# EAGLE design v4.0 (EAGLE 7.5.0)
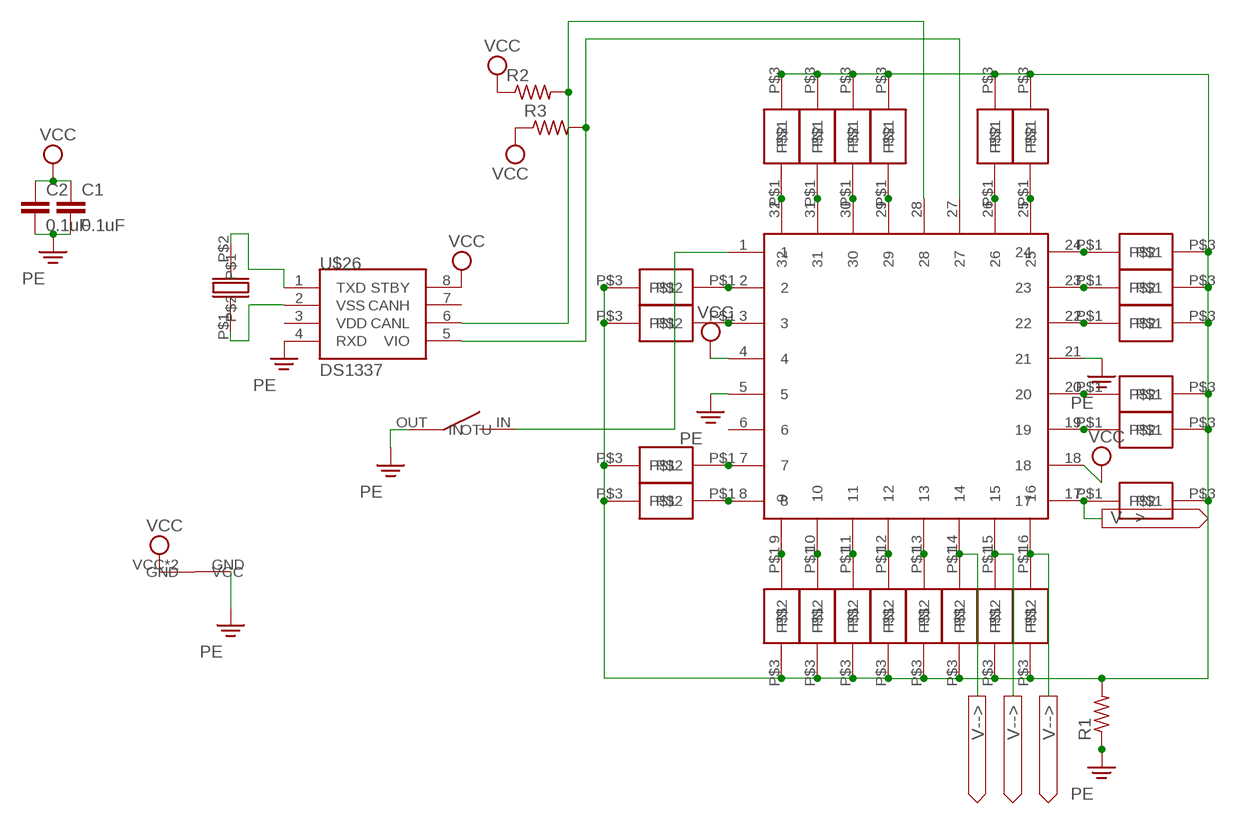
[diagram p0: schematic, sheet 1]

## Parts
C1  0.1uF  C-EUC0805K  [C0805K]
C2  0.1uF  C-EUC0805K  [C0805K]
R1  R-US_R0805  [R0805]
R2  R-US_R0805  [R0805]
R3  R-US_R0805  [R0805]
U$1  SMDLED  [SMDLED]
U$2  SMDLED  [SMDLED]
U$3  SMDLED  [SMDLED]
U$4  SMDLED  [SMDLED]
U$5  SMDLED  [SMDLED]
U$6  SMDLED  [SMDLED]
U$7  SMDLED  [SMDLED]
U$8  SMDLED  [SMDLED]
U$9  SMDLED  [SMDLED]
U$10  SMDLED  [SMDLED]
U$11  SMDLED  [SMDLED]
U$12  SMDLED  [SMDLED]
U$13  SMDLED  [SMDLED]
U$14  SMDLED  [SMDLED]
U$15  SMDLED  [SMDLED]
U$16  SMDLED  [SMDLED]
U$17  SMDLED  [SMDLED]
U$18  SMDLED  [SMDLED]
U$19  SMDLED  [SMDLED]
U$20  SMDLED  [SMDLED]
U$21  SMDLED  [SMDLED]
U$22  SMDLED  [SMDLED]
U$23  SMDLED  [SMDLED]
U$24  SMDLED  [SMDLED]
U$25  ATTINY88  [32-TQFT]
U$26  DS1337  [8-SOIC]
U$27  BAT2009  [BAT2009]
U$28  INT2  [INT2]
U$29  SMDCRYSTAL  [SMDCRYSTAL]

## Nets
N$1: U$16.P$1 U$25.2
N$2: U$17.P$1 U$25.3
N$3: U$7.P$1 U$25.7
N$4: U$8.P$1 U$25.8
N$5: U$18.P$1 U$25.9
N$6: U$19.P$1 U$25.10
N$7: U$20.P$1 U$25.11
N$8: U$1.P$1 U$25.12
N$9: U$2.P$1 U$25.13
N$10: U$4.P$1 U$25.15
N$11: U$3.P$1 U$25.14
N$12: U$5.P$1 U$25.16
N$13: U$11.P$1 U$25.17
N$14: U$24.P$1 U$25.26
N$15: U$9.P$1 U$25.25
N$16: U$6.P$1 U$25.24
N$17: U$22.P$1 U$25.23
N$18: U$21.P$1 U$25.22
N$19: U$25.1 U$28.IN
N$20: U$10.P$1 U$25.20
N$21: U$23.P$1 U$25.29
N$22: U$13.P$1 U$25.30
N$23: U$14.P$1 U$25.31
N$24: U$15.P$1 U$25.32
N$25: R1.2 U$1.P$3 U$2.P$3 U$3.P$3 U$4.P$3 U$5.P$3 U$6.P$3 U$7.P$3 U$8.P$3 U$9.P$3 U$10.P$3 U$11.P$3 U$12.P$3 U$13.P$3 U$14.P$3 U$15.P$3 U$16.P$3 U$17.P$3 U$18.P$3 U$19.P$3 U$20.P$3 U$21.P$3 U$22.P$3 U$23.P$3 U$24.P$3
N$26: U$12.P$1 U$25.19
N$29: U$26.2(VSS) U$29.P$1
N$30: U$26.1(TXD) U$29.P$2
PE: C1.2 C2.2 R1.1 U$25.5 U$25.21 U$26.4(RXD) U$27.GND U$28.OUT(OTU)
SCL: R2.2 U$25.28 U$26.6(CANL)
SDA: R3.2 U$25.27 U$26.5(VIO)
VCC: C1.1 C2.1 R2.1 R3.1 U$25.4 U$25.18 U$26.8(STBY) U$27.VCC U$27.VCC2(VCC)
Unconnected: U$25.6 U$26.3(VDD) U$26.7(CANH)

## Library data of the parts
C1 C2 = rcl:C-EU: CAPACITOR, European symbol
R1-R3 = resistor:R-US_: RESISTOR, American symbol
U$1-U$24 = custom:SMDLED
U$25 = custom:ATTINY88
U$26 = _custom:DS1337
U$27 = custom:BAT2009
U$28 = custom:INT2
U$29 = custom:SMDCRYSTAL

## Board
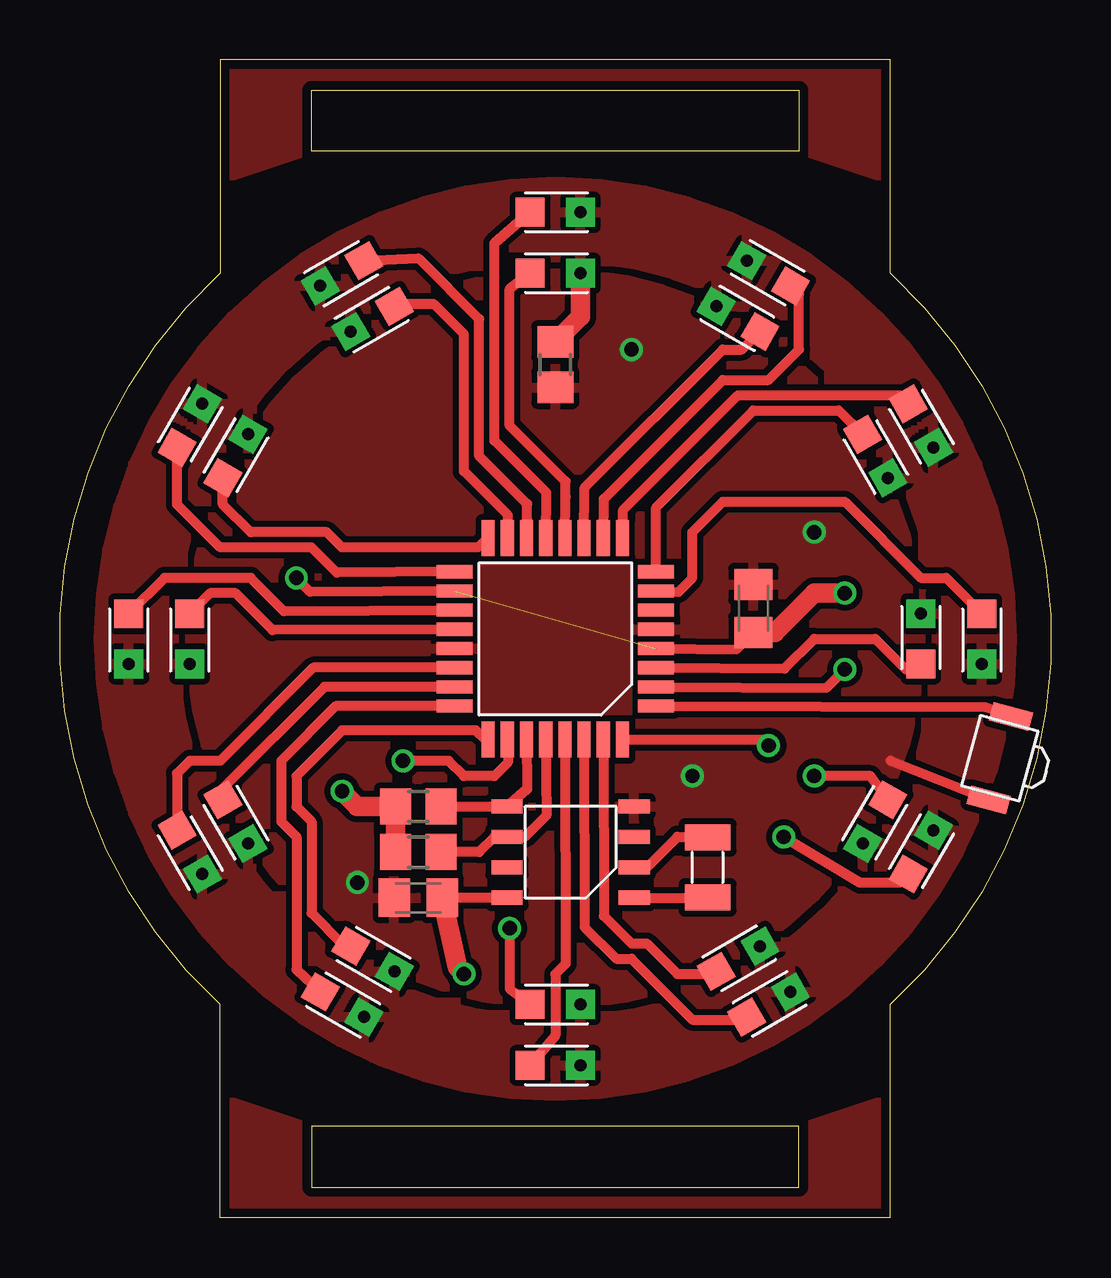
[diagram p1: board, top side]
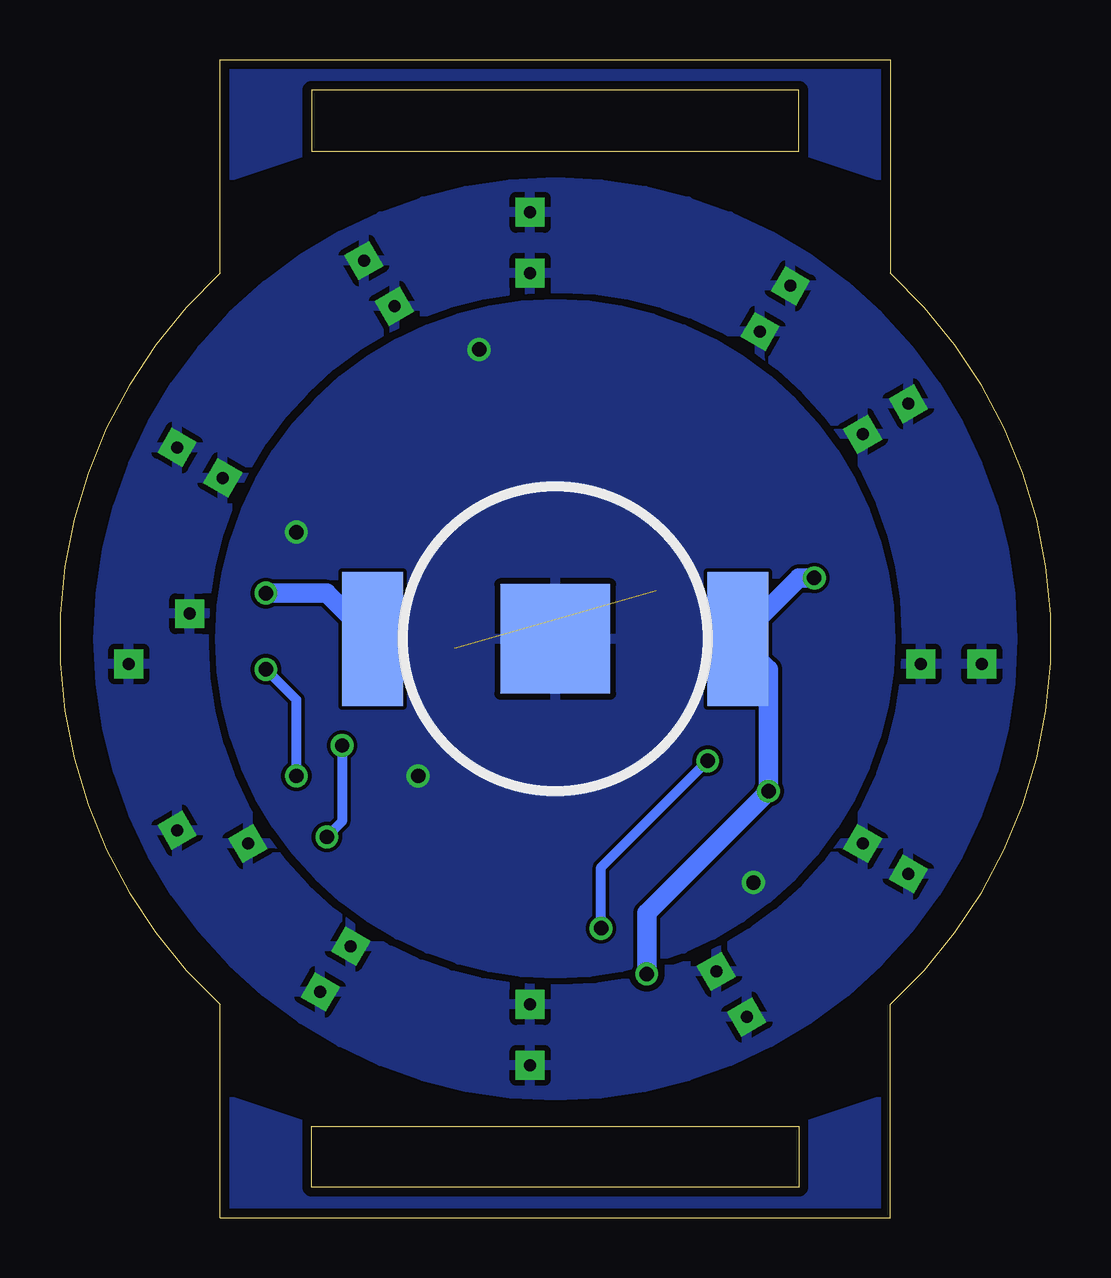
[diagram p2: board, bottom side, seen from below]

Size 41.3 x 48.26 mm. Coordinates in mm from the lower left corner, seen from the top.
Outline: 34.62,0 6.68,0 6.68,8.89 arc-95 6.68,39.37 6.68,48.26 34.62,48.26 34.62,39.37 arc-95 34.62,8.89 34.62,0
Outline: 10.49,1.27 30.81,1.27 30.81,3.81 10.49,3.81 10.49,1.27
Outline: 10.49,46.99 30.81,46.99 30.81,44.45 10.49,44.45 10.49,46.99
Copper layers (1*16): Top 0.0356mm / dielectric 1.5011mm / Bottom 0.0356mm
Design rules "oshpark-2layer": minimum track width 6mil, minimum drill 13mil, track to track 6mil, track to pad 6mil, pad to pad 6mil, via to via 6mil, smd to smd 6mil, copper to edge 15mil, drill to drill 6mil, minimum pad ring 7mil, minimum via ring 7mil, stop-mask expansion 2.5mil, vias tented up to drill 0mil, thermal gap 10mil

### Footprints (pad centres in the part's own frame; a part is rotated, then mirrored left to right if it is on the bottom)
C0805K = smd 1.3 x 1.6: 1 -1,0; 2 1,0
R0805 = smd 1.3 x 1.5: 1 -0.95,0; 2 0.95,0
SMDLED = smd 1.2 x 1.2: P$1 0,1.05 | drill 0.5 pad 1.2 square: P$3 0,-1.05
32-TQFT = smd 1.5 x 0.55: 1 -4.2,2.8; 2 -4.2,2; 3 -4.2,1.2; 4 -4.2,0.4; 5 -4.2,-0.4; 6 -4.2,-1.2; 7 -4.2,-2; 8 -4.2,-2.8; 17 4.2,-2.8; 18 4.2,-2; 19 4.2,-1.2; 20 4.2,-0.4; 21 4.2,0.4; 22 4.2,1.2; 23 4.2,2; 24 4.2,2.8 | smd 0.55 x 1.5: 9 -2.8,-4.2; 10 -2,-4.2; 11 -1.2,-4.2; 12 -0.4,-4.2; 13 0.4,-4.2; 14 1.2,-4.2; 15 2,-4.2; 16 2.8,-4.2; 25 2.8,4.2; 26 2,4.2; 27 1.2,4.2; 28 0.4,4.2; 29 -0.4,4.2; 30 -1.2,4.2; 31 -2,4.2; 32 -2.8,4.2
8-SOIC = smd 1.3 x 0.6: 1 -2.65,1.905; 2 -2.65,0.635; 3 -2.65,-0.635; 4 -2.65,-1.905; 5 2.65,-1.905; 6 2.65,-0.635; 7 2.65,0.635; 8 2.65,1.905
BAT2009 = smd 4.572 x 4.572: GND 0,0 | smd 2.54 x 5.588: VCC -7.62,0; VCC2 7.62,0
INT2 = smd 0.8 x 1.7: IN -1.8,0; OUT 1.8,0
SMDCRYSTAL = smd 1.1 x 1.9: P$1 -1.25,0; P$2 1.25,0

### Placement (x,y rotation side)
C1  28.9,25.4 90 top
C2  14.93,13.33 180 top
R1  20.65,35.56 90 top
R2  14.93,15.24 0 top
R3  14.93,17.14 0 top
U$1  20.65,39.37 90 top
U$2  20.65,41.91 90 top
U$3  11.76,39.37 300 top
U$4  13.03,37.47 300 top
U$5  7.31,31.75 150 top
U$6  11.76,8.89 60 top
U$7  38.43,24.13 0 top
U$8  33.98,31.75 30 top
U$9  13.03,10.79 60 top
U$10  5.41,24.13 0 top
U$11  5.41,33.02 150 top
U$12  2.87,24.13 0 top
U$13  29.54,8.89 120 top
U$14  28.27,10.79 120 top
U$15  35.89,15.24 150 top
U$16  33.98,16.51 330 top
U$17  35.89,24.13 180 top
U$18  35.89,33.02 30 top
U$19  29.54,39.37 240 top
U$20  28.27,37.47 240 top
U$21  5.41,15.24 30 top
U$22  7.31,16.51 30 top
U$23  20.65,6.35 90 top
U$24  20.65,8.89 90 top
U$25  20.65,24.13 180 top
U$26  21.28,15.24 180 top
U$27  20.65,24.13 180 bottom
U$28  39.18,19.16 255 top
U$29  27,14.6 270 top

### Tracks (layer width: path | path; a pad name or v marks a point on that pad's centre or on a via)
N$1  (via drill 0.6)
  Top 0.406: U$25.2 31.94,22.09 v32.71,22.86 | U$16.P$1 33.79,18.41 v31.44,18.41
  Bottom 0.406: v31.44,18.41 31.44,21.59 v32.71,22.86
N$2
  Top 0.406: U$25.3 30.2,22.89 31.44,24.13 33.98,24.13 35.25,22.86 35.87,22.86 U$17.P$1
N$3
  Top 0.406: U$25.7 25.78,26.09 26.36,26.67 26.36,28.58 27.63,29.84 32.71,29.84 35.89,26.67 36.94,26.67 U$7.P$1
N$4
  Top 0.406: U$8.P$1 32.46,33.66 28.9,33.66 24.85,29.6 U$25.8
N$5
  Top 0.406: U$25.9 23.47,29.49 28.27,34.29 35,34.29 U$18.P$1
N$6
  Top 0.406: U$25.10 22.67,29.96 27.63,34.93 29.54,34.93 30.81,36.2 30.81,38.48 U$19.P$1
N$7
  Top 0.406: U$25.11 21.87,30.43 27.63,36.2 28.43,36.2 U$20.P$1
N$8
  Top 0.406: U$1.P$1 18.74,38.72 18.74,33.02 21.07,30.69 21.07,30.06 U$25.12
N$9
  Top 0.406: U$2.P$1 18.11,40.62 18.11,32.38 20.27,30.22 20.27,29.59 U$25.13
N$10
  Top 0.406: U$4.P$1 14.12,38.1 15.57,38.1 16.84,36.83 16.84,31.12 18.67,29.28 18.67,28.65 U$25.15
N$11
  Top 0.406: U$3.P$1 14.94,40 17.47,37.47 17.47,31.75 19.47,29.75 19.47,29.12 U$25.14
N$12
  Top 0.406: U$5.P$1 6.79,29.73 7.95,28.58 11.12,28.58 11.76,27.94 17.42,27.94 17.81,28.33 U$25.16
N$13
  Top 0.406: U$25.17 11.54,26.89 10.49,27.94 6.68,27.94 4.88,29.73 U$11.P$1
N$14  (via drill 0.6)
  Top 0.406: U$25.26 18.67,18.98 18.11,18.41 16.84,18.41 16.2,19.05 v14.3,19.05 | v18.74,12.06 18.74,9.54 U$24.P$1
  Bottom 0.406: v18.74,12.06 18.74,14.6 v14.3,19.05
N$15
  Top 0.406: U$9.P$1 11.77,11.42 10.49,12.7 10.49,16.51 9.85,17.14 9.85,18.41 11.76,20.32 17.34,20.32 17.73,19.93 U$25.25
N$16
  Top 0.406: U$6.P$1 9.85,10.34 9.85,15.87 9.22,16.51 9.22,19.05 11.5,21.33 U$25.24
N$17
  Top 0.406: U$25.23 11.03,22.13 6.79,17.89 U$22.P$1
N$18
  Top 0.406: U$25.22 10.56,22.93 6.68,19.05 5.41,19.05 4.88,18.52 U$21.P$1
N$19
  Top 0.406: U$25.1 38.59,21.29 U$28.IN
N$20
  Top 0.406: U$25.20 8.86,24.49 7.31,26.04 6.26,26.04 U$10.P$1
N$21
  Top 0.406: U$23.P$1 20.65,7.6 20.65,10.16 21.07,10.58 U$25.29
N$22
  Top 0.406: U$13.P$1 28.45,8.26 26.36,8.26 23.82,10.79 23.19,10.79 21.87,12.11 U$25.30
N$23
  Top 0.406: U$25.31 22.67,12.58 23.82,11.43 24.46,11.43 25.73,10.16 27.18,10.16 U$14.P$1
N$24  (via drill 0.6)
  Top 0.406: U$25.32 29.29,19.93 v29.54,19.69 | v30.17,15.87 33.35,13.97 35,13.97 U$15.P$1
  Bottom 0.406: v29.54,19.69 29.54,16.51 v30.17,15.87
N$25
  Top 0.813: R1.2 21.7,37.56 U$1.P$3
  pour Bottom (isolate 0.254, rank 2): 20.65,5.08 arc180 20.65,43.18 arc180
  pour Top (isolate 0.254, rank 3): 20.65,5.08 arc180 20.65,43.18 arc180
N$26
  Top 0.406: U$12.P$1 4.36,26.67 7.95,26.67 9.33,25.29 U$25.19
N$27
  pour Top (isolate 0.254, rank 6): 34.62,0 6.68,0 6.68,5.08 10.49,3.81 10.49,1.27 30.81,1.27 30.81,3.81 34.62,5.08
N$28
  pour Bottom (isolate 0.254, rank 6): 34.62,0 6.68,0 6.68,5.08 10.49,3.81 10.49,1.27 30.81,1.27 30.81,3.81 34.62,5.08
N$29
  Top 0.406: U$26.2 24.46,14.6 25.73,15.87 26.98,15.87 U$29.P$1
N$30
  Top 0.406: U$26.1 26.98,13.33 U$29.P$2
N$32
  pour Bottom (isolate 0.254, rank 6): 30.81,44.45 34.62,43.18 34.62,48.26 6.68,48.26 6.68,43.18 10.49,44.45 10.49,46.99 30.81,46.99
N$33
  pour Top (isolate 0.254, rank 6): 34.62,43.18 34.62,48.26 6.68,48.26 6.68,43.18 10.49,44.45 10.49,46.99 30.81,46.99 30.81,44.45
PE  (via drill 0.6)
  Top 0.406: U$28.OUT 34.62,19.05
  other vias: 23.82,36.2 31.44,28.58 26.36,18.41 12.39,13.97
  pour Top (isolate 0.254): 20.65,8.89 arc180 20.65,39.37 arc180
  pour Bottom: 
  pour Bottom: 
  pour Bottom: 20.65,10.16 arc180 20.65,38.1 arc180
SCL
  Top 0.406: U$25.28 20.27,16.77 19.38,15.87 U$26.6 18.11,15.87 17.47,15.24 R2.2
SDA
  Top 0.406: U$25.27 19.47,17.87 U$26.5 R3.2
VCC  (via drill 0.6)  (1 unrouted)
  Top 0.406: U$26.8 C2.1 | U$25.18 10.43,26.09 v9.85,26.67 | U$25.4 28.19,23.69 C1.1
  Top 0.813: R2.1 R3.1 12.39,17.14 v11.76,17.78 | v32.71,26.04 31.44,26.04 29.81,24.4 C1.1 | C2.1 16.57,10.43 v16.84,10.16
  Bottom 0.813: v9.85,26.67 10.49,26.67 U$27.VCC 11.76,22.86 v11.76,17.78 16.84,12.7 v16.84,10.16 | U$27.VCC2 30.17,26.04 v32.71,26.04